# Altium schematic sheet Microcontroller Schematic.SchDoc
size A; SheetNumber: 1; SheetTotal: 1
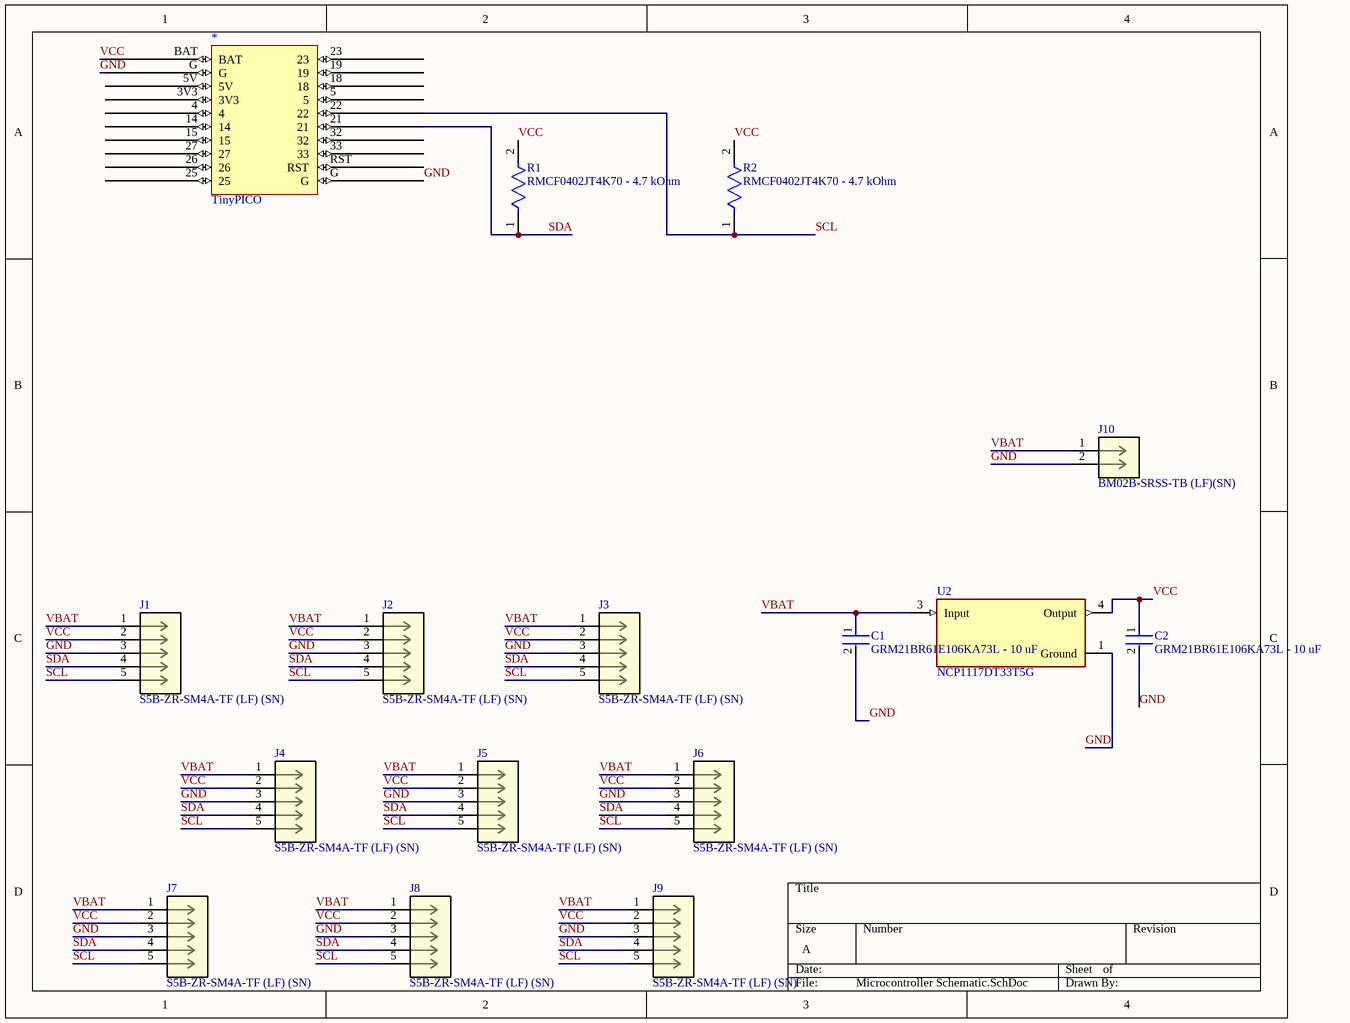
[diagram p0: Microcontroller Schematic.SchDoc]

## Parts
*  TinyPICO  [TinyPICO Board]
C1  GRM21BR61E106KA73L - 10 uF  [FP-GRM21B-0_15-IPC_C]
C2  GRM21BR61E106KA73L - 10 uF  [FP-GRM21B-0_15-IPC_C]
J1  S5B-ZR-SM4A-TF (LF) (SN)  [CONN_S5B-ZR-SM4A-TF_JST]
J2  S5B-ZR-SM4A-TF (LF) (SN)  [CONN_S5B-ZR-SM4A-TF_JST]
J3  S5B-ZR-SM4A-TF (LF) (SN)  [CONN_S5B-ZR-SM4A-TF_JST]
J4  S5B-ZR-SM4A-TF (LF) (SN)  [CONN_S5B-ZR-SM4A-TF_JST]
J5  S5B-ZR-SM4A-TF (LF) (SN)  [CONN_S5B-ZR-SM4A-TF_JST]
J6  S5B-ZR-SM4A-TF (LF) (SN)  [CONN_S5B-ZR-SM4A-TF_JST]
J7  S5B-ZR-SM4A-TF (LF) (SN)  [CONN_S5B-ZR-SM4A-TF_JST]
J8  S5B-ZR-SM4A-TF (LF) (SN)  [CONN_S5B-ZR-SM4A-TF_JST]
J9  S5B-ZR-SM4A-TF (LF) (SN)  [CONN_S5B-ZR-SM4A-TF_JST]
J10  BM02B-SRSS-TB (LF)(SN)  [CONN_BM02B-SRSS-TB_JST]
R1  RMCF0402JT4K70 - 4.7 kOhm  [FP-RMCF0402-MFG]
R2  RMCF0402JT4K70 - 4.7 kOhm  [FP-RMCF0402-MFG]
U2  NCP1117DT33T5G  [FP-369C-MFG]

## Nets
GND: *.G C1.2 C2.2 J1.3 J2.3 J3.3 J4.3 J5.3 J6.3 J7.3 J8.3 J9.3 J10.2 U2.1(Ground)
SCL: *.22 J1.5 J2.5 J3.5 J4.5 J5.5 J6.5 J7.5 J8.5 J9.5 R2.1
SDA: *.21 J1.4 J2.4 J3.4 J4.4 J5.4 J6.4 J7.4 J8.4 J9.4 R1.1
VBAT: C1.1 J1.1 J2.1 J3.1 J4.1 J5.1 J6.1 J7.1 J8.1 J9.1 J10.1 U2.3(Input)
VCC: *.BAT C2.1 J1.2 J2.2 J3.2 J4.2 J5.2 J6.2 J7.2 J8.2 J9.2 R1.2 R2.2 U2.4(Output)

Not connected (* = marked no-connect by the designer): * 3V3 4 5 5V 14 15 18 19 23 25 26 27 32 33 RST

## Library data of the parts
C1 C2 = CMP-2007-03541-2: Chip Multilayer Ceramic Capacitors for General Purpose, 0805, 10uF, X5R, 15%, 10%, 25V; Length: 2mm; Depth: 1.25mm; Termination: SMD/SMT; Voltage: 25V; Height: 1.25mm; Material: Ceramic; Thickness: 0.053inch; Radiation Hardening: No; Min Operating Temperature: -55°C; Width: 0.049inch; Package Quantity: 1; Mount: Surface Mount; Dielectric: X5R; Packaging: Tape and Reel; Capacitance: 10uF; Voltage Rating (DC): 25V; Lead Free: Lead Free; Max Operating Temperature: 85°C; Case Code (Imperial): 0805; Case/Package: 0805; Tolerance: 10%; Voltage Rating: 25V; Case Code (Metric): 2012
J1-J9 = S5B-ZR-SM4A-TF (LF) (SN): No Description Available; Mfr_Name: JST; Copyright: Copyright (C) 2021 Ultra Librarian. All rights reserved.; Manufacturer_Part_Number: S5B-ZR-SM4A-TF (LF) (SN); RefDes: RefDes; Type: DEV
J10 = BM02B-SRSS-TB (LF)(SN): No Description Available; Mfr_Name: JST; Copyright: Copyright (C) 2021 Ultra Librarian. All rights reserved.; Manufacturer_Part_Number: BM02B-SRSS-TB (LF)(SN); RefDes: RefDes; Type: DEV
R1 R2 = CMP-2000-06988-2: 4.7kΩ ±5% 0.063W 0402 Thick Film Chip Resistor AEC-Q200 compliant; Resistance: 4.7kR; Power Rating: 63mW; Temperature Coefficient: 100ppm/°C; Case Code (Metric): 1005; Features: Automotive AEC-Q200; Length: 0.039inch; Width: 0.02inch; Min Operating Temperature: -55°C; Depth: 0.5mm; Tolerance: 5%; Contact Plating: Tin; Military Standard: Not; Number of Terminations: 2; Height: 0.016inch; Radiation Hardening: No; Packaging: Tape and Reel; RoHS Compliant: Yes; Max Power Dissipation: 63mW; Case Code (Imperial): 0402; Resistor Type: Thick Film; Series: RMCF; Max Operating Temperature: 155°C; Mount: Surface Mount; Case/Package: 0402; Construction: Rectangular; Lead Free: Lead Free
U2 = CMP-07128-000023-2: IC REG LINEAR 3.3V 1A DPAK; Polarity: Positive; Input Bias Current: 6mA; Quiescent Current: 10mA; Output Type: Fixed; Number of Outputs: 1; Output Voltage Accuracy: 1%; Max Input Voltage: 20V; Dropout Voltage: 1.07V; Reference Voltage: 1.27V; Lead Free: Lead Free; Width: 6.22mm; Min Current Limit: 1A; Case/Package: DPAK; Output Voltage: 3.3V; Halogen Free: Halogen Free; Radiation Hardening: No; Min Operating Temperature: 0°C; Nominal Output Voltage: 3.3V; Output Current: 1A; Package Quantity: 1; Max Operating Temperature: 125°C; Max Output Current: 1A; Number of Regulators: 1; REACH SVHC: No SVHC; Packaging: Tape and Reel; Number of Pins: 3; Height: 2.38mm; Length: 6.73mm; Mount: Surface Mount; Contact Plating: Tin; Accuracy: 1%